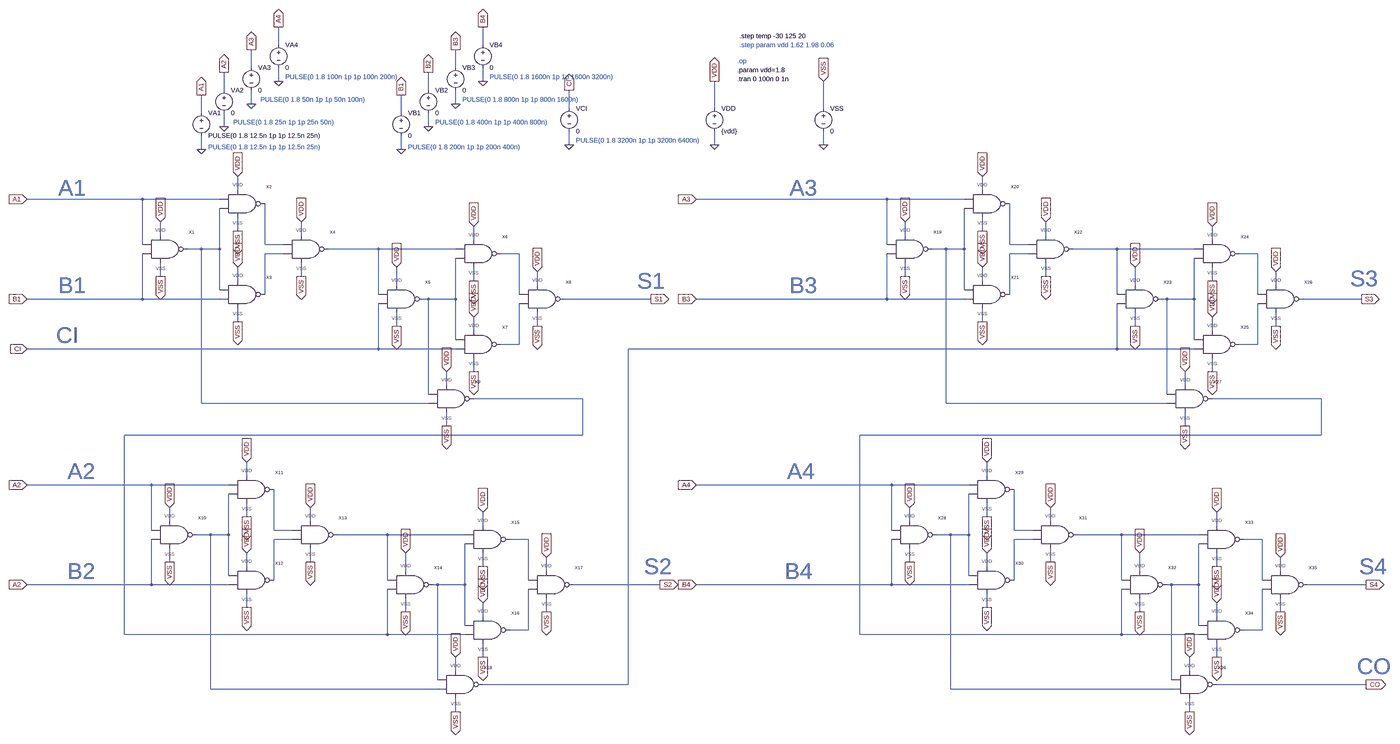
[diagram p0: schematic sumator4bit.asc, whole sheet]
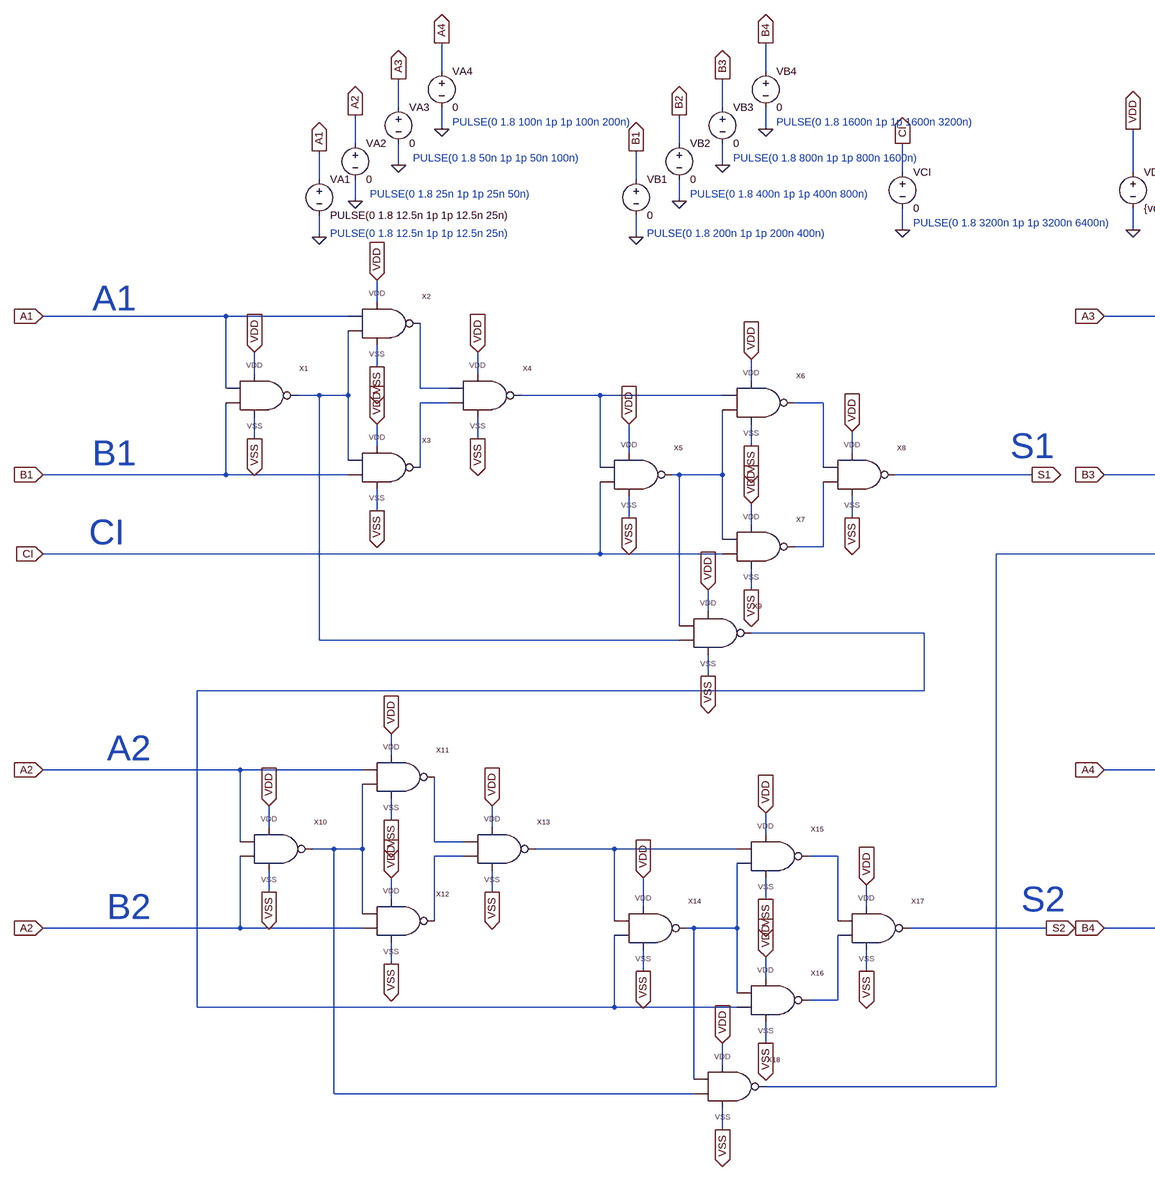
[diagram p1: schematic sumator4bit.asc, part, row 1 of 1, column 1 of 2]
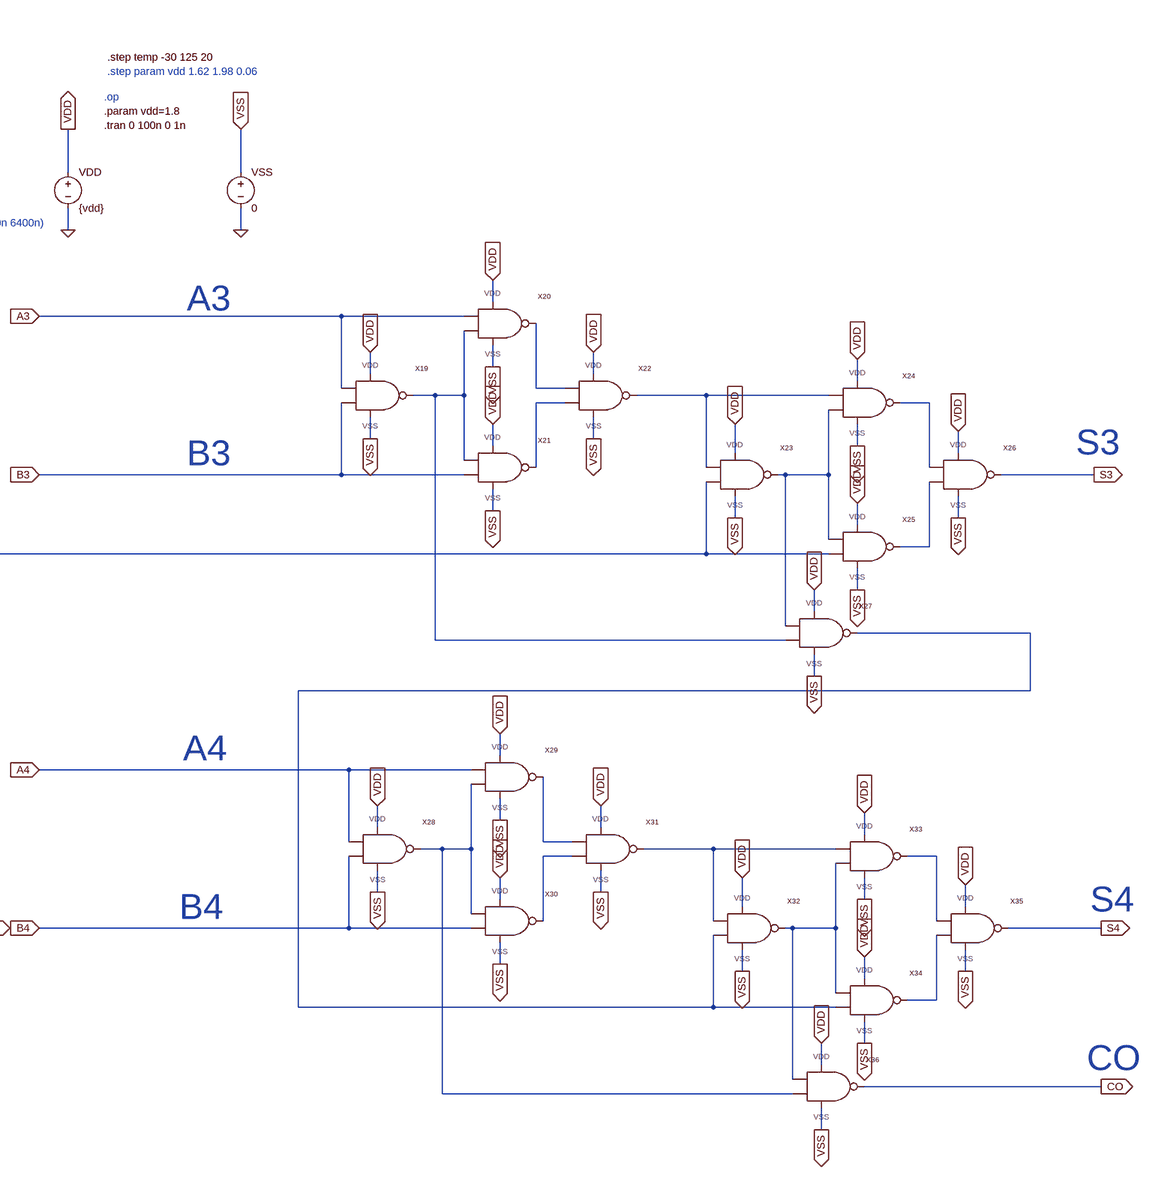
[diagram p2: schematic sumator4bit.asc, part, row 1 of 1, column 2 of 2]
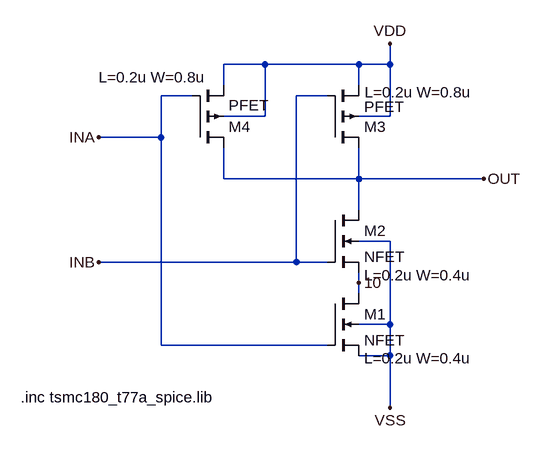
[diagram p3: sub-circuit nand.asc]
sumator4bit.asc, the LTspice schematic file:
Version 4
SHEET 1 4428 3956
WIRE 176 -640 176 -704
WIRE 896 -640 896 -704
WIRE 80 -560 80 -624
WIRE 800 -560 800 -624
WIRE 176 -512 176 -560
WIRE 896 -512 896 -560
WIRE -16 -480 -16 -544
WIRE 704 -480 704 -544
WIRE 80 -432 80 -480
WIRE 800 -432 800 -480
WIRE 1200 -416 1200 -480
WIRE 1712 -416 1712 -512
WIRE 2096 -416 2096 -512
WIRE -96 -400 -96 -464
WIRE 608 -400 608 -464
WIRE -16 -352 -16 -400
WIRE 704 -352 704 -400
WIRE 1200 -288 1200 -336
WIRE 1712 -288 1712 -336
WIRE 2096 -288 2096 -336
WIRE -96 -272 -96 -320
WIRE 608 -272 608 -320
WIRE 32 -128 32 -176
WIRE 2656 -128 2656 -176
WIRE -304 -96 -944 -96
WIRE -32 -96 -304 -96
WIRE 2320 -96 1648 -96
WIRE 2592 -96 2320 -96
WIRE 32 16 32 -32
WIRE 2656 16 2656 -32
WIRE -240 32 -240 -16
WIRE 256 32 256 -16
WIRE 2384 32 2384 -16
WIRE 2880 32 2880 -16
WIRE 864 48 864 0
WIRE 3488 48 3488 0
WIRE -304 64 -304 -96
WIRE 128 64 128 -80
WIRE 192 64 128 64
WIRE 2320 64 2320 -96
WIRE 2752 64 2752 -80
WIRE 2816 64 2752 64
WIRE -96 80 -144 80
WIRE -32 80 -32 -64
WIRE -32 80 -96 80
WIRE 528 80 352 80
WIRE 800 80 528 80
WIRE 2528 80 2480 80
WIRE 2592 80 2592 -64
WIRE 2592 80 2528 80
WIRE 3152 80 2976 80
WIRE 3424 80 3152 80
WIRE 192 96 128 96
WIRE 1024 96 960 96
WIRE 2816 96 2752 96
WIRE 3648 96 3584 96
WIRE -240 176 -240 128
WIRE 256 176 256 128
WIRE 2384 176 2384 128
WIRE 2880 176 2880 128
WIRE 32 192 32 144
WIRE 864 192 864 144
WIRE 2656 192 2656 144
WIRE 3488 192 3488 144
WIRE 592 208 592 144
WIRE 1088 208 1088 160
WIRE 3216 208 3216 144
WIRE 3712 208 3712 160
WIRE -32 224 -32 80
WIRE 2592 224 2592 80
WIRE 128 240 128 96
WIRE 528 240 528 80
WIRE 1024 240 1024 96
WIRE 2752 240 2752 96
WIRE 3152 240 3152 80
WIRE 3648 240 3648 96
WIRE -304 256 -304 96
WIRE -304 256 -944 256
WIRE -32 256 -304 256
WIRE 704 256 688 256
WIRE 800 256 800 112
WIRE 800 256 704 256
WIRE 1488 256 1184 256
WIRE 2320 256 2320 96
WIRE 2320 256 1648 256
WIRE 2592 256 2320 256
WIRE 3328 256 3312 256
WIRE 3424 256 3424 112
WIRE 3424 256 3328 256
WIRE 4112 256 3808 256
WIRE 32 336 32 288
WIRE 2656 336 2656 288
WIRE 592 352 592 304
WIRE 1088 352 1088 304
WIRE 3216 352 3216 304
WIRE 3712 352 3712 304
WIRE 864 368 864 320
WIRE 3488 368 3488 320
WIRE 800 400 800 256
WIRE 3424 400 3424 256
WIRE 1024 416 1024 272
WIRE 1024 416 960 416
WIRE 3648 416 3648 272
WIRE 3648 416 3584 416
WIRE 528 432 528 272
WIRE 528 432 -944 432
WIRE 800 432 528 432
WIRE 3152 432 3152 272
WIRE 3152 432 1408 432
WIRE 3424 432 3152 432
WIRE 864 512 864 464
WIRE 3488 512 3488 464
WIRE 768 560 768 512
WIRE 3392 560 3392 512
WIRE 704 592 704 256
WIRE 3328 592 3328 256
WIRE 1248 608 864 608
WIRE 3872 608 3488 608
WIRE -96 624 -96 80
WIRE 704 624 -96 624
WIRE 2528 624 2528 80
WIRE 3328 624 2528 624
WIRE 768 704 768 656
WIRE 3392 704 3392 656
WIRE 1248 736 1248 608
WIRE 1248 736 -368 736
WIRE 3872 736 3872 608
WIRE 3872 736 2224 736
WIRE 64 880 64 832
WIRE 2672 880 2672 832
WIRE -272 912 -944 912
WIRE 0 912 -272 912
WIRE 2336 912 1648 912
WIRE 2608 912 2336 912
WIRE 64 1024 64 976
WIRE 2672 1024 2672 976
WIRE -208 1040 -208 992
WIRE 288 1040 288 992
WIRE 2400 1040 2400 992
WIRE 2896 1040 2896 992
WIRE 896 1056 896 1008
WIRE 3504 1056 3504 1008
WIRE -272 1072 -272 912
WIRE 160 1072 160 928
WIRE 224 1072 160 1072
WIRE 2336 1072 2336 912
WIRE 2768 1072 2768 928
WIRE 2832 1072 2768 1072
WIRE -64 1088 -112 1088
WIRE 0 1088 0 944
WIRE 0 1088 -64 1088
WIRE 560 1088 384 1088
WIRE 832 1088 560 1088
WIRE 2544 1088 2496 1088
WIRE 2608 1088 2608 944
WIRE 2608 1088 2544 1088
WIRE 3168 1088 2992 1088
WIRE 3440 1088 3168 1088
WIRE 224 1104 160 1104
WIRE 1056 1104 992 1104
WIRE 2832 1104 2768 1104
WIRE 3664 1104 3600 1104
WIRE -208 1184 -208 1136
WIRE 288 1184 288 1136
WIRE 2400 1184 2400 1136
WIRE 2896 1184 2896 1136
WIRE 64 1200 64 1152
WIRE 896 1200 896 1152
WIRE 2672 1200 2672 1152
WIRE 3504 1200 3504 1152
WIRE 624 1216 624 1152
WIRE 1120 1216 1120 1168
WIRE 3232 1216 3232 1152
WIRE 3728 1216 3728 1168
WIRE 0 1232 0 1088
WIRE 2608 1232 2608 1088
WIRE 160 1248 160 1104
WIRE 560 1248 560 1088
WIRE 1056 1248 1056 1104
WIRE 2768 1248 2768 1104
WIRE 3168 1248 3168 1088
WIRE 3664 1248 3664 1104
WIRE -272 1264 -272 1104
WIRE -272 1264 -944 1264
WIRE 0 1264 -272 1264
WIRE 736 1264 720 1264
WIRE 832 1264 832 1120
WIRE 832 1264 736 1264
WIRE 1520 1264 1216 1264
WIRE 2336 1264 2336 1104
WIRE 2336 1264 1648 1264
WIRE 2608 1264 2336 1264
WIRE 3344 1264 3328 1264
WIRE 3440 1264 3440 1120
WIRE 3440 1264 3344 1264
WIRE 4128 1264 3824 1264
WIRE 64 1344 64 1296
WIRE 2672 1344 2672 1296
WIRE 624 1360 624 1312
WIRE 1120 1360 1120 1312
WIRE 3232 1360 3232 1312
WIRE 3728 1360 3728 1312
WIRE 896 1376 896 1328
WIRE 3504 1376 3504 1328
WIRE 832 1408 832 1264
WIRE 3440 1408 3440 1264
WIRE 1056 1424 1056 1280
WIRE 1056 1424 992 1424
WIRE 3664 1424 3664 1280
WIRE 3664 1424 3600 1424
WIRE -368 1440 -368 736
WIRE 560 1440 560 1280
WIRE 560 1440 -368 1440
WIRE 832 1440 560 1440
WIRE 2224 1440 2224 736
WIRE 3168 1440 3168 1280
WIRE 3168 1440 2224 1440
WIRE 3440 1440 3168 1440
WIRE 896 1520 896 1472
WIRE 3504 1520 3504 1472
WIRE 800 1568 800 1520
WIRE 3408 1568 3408 1520
WIRE 736 1600 736 1264
WIRE 3344 1600 3344 1264
WIRE 1408 1616 1408 432
WIRE 1408 1616 896 1616
WIRE 4128 1616 3504 1616
WIRE -64 1632 -64 1088
WIRE 736 1632 -64 1632
WIRE 2544 1632 2544 1088
WIRE 3344 1632 2544 1632
WIRE 800 1712 800 1664
WIRE 3408 1712 3408 1664
FLAG 1488 256 S1
IOPIN 1488 256 Out
FLAG 608 -272 0
FLAG -96 -272 0
FLAG 1712 -512 VDD
IOPIN 1712 -512 Out
FLAG 32 -176 VDD
IOPIN 32 -176 In
FLAG 32 144 VDD
IOPIN 32 144 In
FLAG -240 -16 VDD
IOPIN -240 -16 In
FLAG 256 -16 VDD
IOPIN 256 -16 In
FLAG 592 144 VDD
IOPIN 592 144 In
FLAG 864 320 VDD
IOPIN 864 320 In
FLAG 1088 160 VDD
IOPIN 1088 160 In
FLAG 864 0 VDD
IOPIN 864 0 In
FLAG 768 512 VDD
IOPIN 768 512 In
FLAG 1712 -288 0
FLAG 1200 -288 0
FLAG 1520 1264 S2
IOPIN 1520 1264 Out
FLAG 64 832 VDD
IOPIN 64 832 In
FLAG 64 1152 VDD
IOPIN 64 1152 In
FLAG -208 992 VDD
IOPIN -208 992 In
FLAG 288 992 VDD
IOPIN 288 992 In
FLAG 624 1152 VDD
IOPIN 624 1152 In
FLAG 896 1328 VDD
IOPIN 896 1328 In
FLAG 1120 1168 VDD
IOPIN 1120 1168 In
FLAG 896 1008 VDD
IOPIN 896 1008 In
FLAG 800 1520 VDD
IOPIN 800 1520 In
FLAG 4112 256 S3
IOPIN 4112 256 Out
FLAG 2656 -176 VDD
IOPIN 2656 -176 In
FLAG 2656 144 VDD
IOPIN 2656 144 In
FLAG 2384 -16 VDD
IOPIN 2384 -16 In
FLAG 2880 -16 VDD
IOPIN 2880 -16 In
FLAG 3216 144 VDD
IOPIN 3216 144 In
FLAG 3488 320 VDD
IOPIN 3488 320 In
FLAG 3712 160 VDD
IOPIN 3712 160 In
FLAG 3488 0 VDD
IOPIN 3488 0 In
FLAG 3392 512 VDD
IOPIN 3392 512 In
FLAG 4128 1264 S4
IOPIN 4128 1264 Out
FLAG 2672 832 VDD
IOPIN 2672 832 In
FLAG 2672 1152 VDD
IOPIN 2672 1152 In
FLAG 2400 992 VDD
IOPIN 2400 992 In
FLAG 2896 992 VDD
IOPIN 2896 992 In
FLAG 3232 1152 VDD
IOPIN 3232 1152 In
FLAG 3504 1328 VDD
IOPIN 3504 1328 In
FLAG 3728 1168 VDD
IOPIN 3728 1168 In
FLAG 3504 1008 VDD
IOPIN 3504 1008 In
FLAG 3408 1520 VDD
IOPIN 3408 1520 In
FLAG 4128 1616 CO
IOPIN 4128 1616 Out
FLAG -16 -352 0
FLAG 704 -352 0
FLAG 80 -432 0
FLAG 800 -432 0
FLAG 176 -512 0
FLAG 896 -512 0
FLAG -96 -464 A1
IOPIN -96 -464 Out
FLAG -16 -544 A2
IOPIN -16 -544 Out
FLAG 80 -624 A3
IOPIN 80 -624 Out
FLAG 176 -704 A4
IOPIN 176 -704 Out
FLAG 608 -464 B1
IOPIN 608 -464 Out
FLAG 704 -544 B2
IOPIN 704 -544 Out
FLAG 800 -624 B3
IOPIN 800 -624 Out
FLAG 896 -704 B4
IOPIN 896 -704 Out
FLAG 1200 -480 CI
IOPIN 1200 -480 Out
FLAG -944 -96 A1
IOPIN -944 -96 In
FLAG -944 256 B1
IOPIN -944 256 In
FLAG -944 432 CI
IOPIN -944 432 In
FLAG -944 912 A2
IOPIN -944 912 In
FLAG -944 1264 A2
IOPIN -944 1264 In
FLAG 1648 -96 A3
IOPIN 1648 -96 In
FLAG 1648 256 B3
IOPIN 1648 256 In
FLAG 1648 912 A4
IOPIN 1648 912 In
FLAG 1648 1264 B4
IOPIN 1648 1264 In
FLAG 2096 -288 0
FLAG 2096 -512 VSS
IOPIN 2096 -512 In
FLAG -240 176 VSS
IOPIN -240 176 Out
FLAG 32 16 VSS
IOPIN 32 16 Out
FLAG 32 336 VSS
IOPIN 32 336 Out
FLAG 256 176 VSS
IOPIN 256 176 Out
FLAG 592 352 VSS
IOPIN 592 352 Out
FLAG 864 192 VSS
IOPIN 864 192 Out
FLAG 1088 352 VSS
IOPIN 1088 352 Out
FLAG 864 512 VSS
IOPIN 864 512 Out
FLAG 768 704 VSS
IOPIN 768 704 Out
FLAG -208 1184 VSS
IOPIN -208 1184 Out
FLAG 64 1024 VSS
IOPIN 64 1024 Out
FLAG 288 1184 VSS
IOPIN 288 1184 Out
FLAG 64 1344 VSS
IOPIN 64 1344 Out
FLAG 624 1360 VSS
IOPIN 624 1360 Out
FLAG 896 1200 VSS
IOPIN 896 1200 Out
FLAG 1120 1360 VSS
IOPIN 1120 1360 Out
FLAG 896 1520 VSS
IOPIN 896 1520 Out
FLAG 800 1712 VSS
IOPIN 800 1712 Out
FLAG 2400 1184 VSS
IOPIN 2400 1184 Out
FLAG 2672 1344 VSS
IOPIN 2672 1344 Out
FLAG 2896 1184 VSS
IOPIN 2896 1184 Out
FLAG 2672 1024 VSS
IOPIN 2672 1024 Out
FLAG 2384 176 VSS
IOPIN 2384 176 Out
FLAG 2656 16 VSS
IOPIN 2656 16 Out
FLAG 2656 336 VSS
IOPIN 2656 336 Out
FLAG 2880 176 VSS
IOPIN 2880 176 Out
FLAG 3216 352 VSS
IOPIN 3216 352 Out
FLAG 3488 512 VSS
IOPIN 3488 512 Out
FLAG 3712 352 VSS
IOPIN 3712 352 Out
FLAG 3488 192 VSS
IOPIN 3488 192 Out
FLAG 3392 704 VSS
IOPIN 3392 704 Out
FLAG 3504 1200 VSS
IOPIN 3504 1200 Out
FLAG 3232 1360 VSS
IOPIN 3232 1360 Out
FLAG 3728 1360 VSS
IOPIN 3728 1360 Out
FLAG 3504 1520 VSS
IOPIN 3504 1520 Out
FLAG 3408 1712 VSS
IOPIN 3408 1712 Out
SYMBOL NAND -240 80 R0
SYMATTR InstName X1
SYMBOL voltage 1712 -432 R0
WINDOW 123 0 0 Left 0
WINDOW 39 0 0 Left 0
SYMATTR InstName VDD
SYMATTR Value {vdd}
SYMBOL voltage 608 -416 R0
WINDOW 123 0 0 Left 0
WINDOW 39 0 0 Left 0
SYMATTR InstName VB1
SYMATTR Value 0
SYMBOL voltage -96 -416 R0
WINDOW 123 0 0 Left 0
WINDOW 39 0 0 Left 0
SYMATTR InstName VA1
SYMATTR Value PULSE(0 1.8 12.5n 1p 1p 12.5n 25n)
SYMBOL NAND 32 -80 R0
SYMATTR InstName X2
SYMBOL NAND 32 240 R0
SYMATTR InstName X3
SYMBOL NAND 256 80 R0
SYMATTR InstName X4
SYMBOL NAND 592 256 R0
SYMATTR InstName X5
SYMBOL NAND 864 96 R0
SYMATTR InstName X6
SYMBOL NAND 864 416 R0
SYMATTR InstName X7
SYMBOL NAND 1088 256 R0
SYMATTR InstName X8
SYMBOL NAND 768 608 R0
SYMATTR InstName X9
SYMBOL voltage 1200 -432 R0
WINDOW 123 0 0 Left 0
WINDOW 39 0 0 Left 0
SYMATTR InstName VCI
SYMATTR Value 0
SYMBOL NAND -208 1088 R0
SYMATTR InstName X10
SYMBOL NAND 64 928 R0
SYMATTR InstName X11
SYMBOL NAND 64 1248 R0
SYMATTR InstName X12
SYMBOL NAND 288 1088 R0
SYMATTR InstName X13
SYMBOL NAND 624 1264 R0
SYMATTR InstName X14
SYMBOL NAND 896 1104 R0
SYMATTR InstName X15
SYMBOL NAND 896 1424 R0
SYMATTR InstName X16
SYMBOL NAND 1120 1264 R0
SYMATTR InstName X17
SYMBOL NAND 800 1616 R0
SYMATTR InstName X18
SYMBOL NAND 2384 80 R0
SYMATTR InstName X19
SYMBOL NAND 2656 -80 R0
SYMATTR InstName X20
SYMBOL NAND 2656 240 R0
SYMATTR InstName X21
SYMBOL NAND 2880 80 R0
SYMATTR InstName X22
SYMBOL NAND 3216 256 R0
SYMATTR InstName X23
SYMBOL NAND 3488 96 R0
SYMATTR InstName X24
SYMBOL NAND 3488 416 R0
SYMATTR InstName X25
SYMBOL NAND 3712 256 R0
SYMATTR InstName X26
SYMBOL NAND 3392 608 R0
SYMATTR InstName X27
SYMBOL NAND 2400 1088 R0
SYMATTR InstName X28
SYMBOL NAND 2672 928 R0
SYMATTR InstName X29
SYMBOL NAND 2672 1248 R0
SYMATTR InstName X30
SYMBOL NAND 2896 1088 R0
SYMATTR InstName X31
SYMBOL NAND 3232 1264 R0
SYMATTR InstName X32
SYMBOL NAND 3504 1104 R0
SYMATTR InstName X33
SYMBOL NAND 3504 1424 R0
SYMATTR InstName X34
SYMBOL NAND 3728 1264 R0
SYMATTR InstName X35
SYMBOL NAND 3408 1616 R0
SYMATTR InstName X36
SYMBOL voltage -16 -496 R0
WINDOW 123 0 0 Left 0
WINDOW 39 0 0 Left 0
SYMATTR InstName VA2
SYMATTR Value 0
SYMBOL voltage 704 -496 R0
WINDOW 123 0 0 Left 0
WINDOW 39 0 0 Left 0
SYMATTR InstName VB2
SYMATTR Value 0
SYMBOL voltage 80 -576 R0
WINDOW 123 0 0 Left 0
WINDOW 39 0 0 Left 0
SYMATTR InstName VA3
SYMATTR Value 0
SYMBOL voltage 800 -576 R0
WINDOW 123 0 0 Left 0
WINDOW 39 0 0 Left 0
SYMATTR InstName VB3
SYMATTR Value 0
SYMBOL voltage 176 -656 R0
WINDOW 123 0 0 Left 0
WINDOW 39 0 0 Left 0
SYMATTR InstName VA4
SYMATTR Value 0
SYMBOL voltage 896 -656 R0
WINDOW 123 0 0 Left 0
WINDOW 39 0 0 Left 0
SYMATTR InstName VB4
SYMATTR Value 0
SYMBOL voltage 2096 -432 R0
WINDOW 123 0 0 Left 0
WINDOW 39 0 0 Left 0
SYMATTR InstName VSS
SYMATTR Value 0
TEXT 1792 -584 Left 2 ;.op
TEXT 1792 -520 Left 2 !.tran 0 100n 0 1n
TEXT 1440 192 Left 6 ;S1
TEXT 1464 1200 Left 6 ;S2
TEXT 4072 184 Left 6 ;S3
TEXT 4104 1200 Left 6 ;S4
TEXT 4096 1552 Left 6 ;CO
TEXT -728 384 Left 6 ;CI
TEXT -720 -136 Left 6 ;A1
TEXT -720 208 Left 6 ;B1
TEXT -688 864 Left 6 ;A2
TEXT 1976 -136 Left 6 ;A3
TEXT 1968 864 Left 6 ;A4
TEXT -688 1216 Left 6 ;B2
TEXT 1976 208 Left 6 ;B3
TEXT 1960 1216 Left 6 ;B4
TEXT -72 -280 Left 2 ;PULSE(0 1.8 12.5n 1p 1p 12.5n 25n)
TEXT 16 -368 Left 2 ;PULSE(0 1.8 25n 1p 1p 25n 50n)
TEXT 112 -448 Left 2 ;PULSE(0 1.8 50n 1p 1p 50n 100n)
TEXT 200 -528 Left 2 ;PULSE(0 1.8 100n 1p 1p 100n 200n)
TEXT 632 -280 Left 2 ;PULSE(0 1.8 200n 1p 1p 200n 400n)
TEXT 728 -368 Left 2 ;PULSE(0 1.8 400n 1p 1p 400n 800n)
TEXT 824 -448 Left 2 ;PULSE(0 1.8 800n 1p 1p 800n 1600n)
TEXT 920 -528 Left 2 ;PULSE(0 1.8 1600n 1p 1p 1600n 3200n)
TEXT 1224 -304 Left 2 ;PULSE(0 1.8 3200n 1p 1p 3200n 6400n)
TEXT 1792 -552 Left 2 !.param vdd=1.8
TEXT 1800 -640 Left 2 ;.step param vdd 1.62 1.98 0.06
TEXT 1800 -672 Left 2 !.step temp -30 125 20

nand.asc, the sub-circuit schematic file:
Version 4
SHEET 1 880 680
WIRE 144 -208 80 -208
WIRE 288 -208 144 -208
WIRE 336 -208 336 -240
WIRE 336 -208 288 -208
WIRE 80 -176 80 -208
WIRE 288 -176 288 -208
WIRE 32 -160 -16 -160
WIRE 240 -160 192 -160
WIRE 144 -128 144 -208
WIRE 144 -128 80 -128
WIRE 336 -128 336 -208
WIRE 336 -128 288 -128
WIRE -16 -96 -16 -160
WIRE -16 -96 -112 -96
WIRE 80 -32 80 -80
WIRE 288 -32 288 -80
WIRE 288 -32 80 -32
WIRE 480 -32 288 -32
WIRE 288 16 288 -32
WIRE 336 64 288 64
WIRE 192 96 192 -160
WIRE 192 96 -112 96
WIRE 240 96 192 96
WIRE 288 128 288 112
WIRE 288 144 288 128
WIRE 336 192 336 64
WIRE 336 192 288 192
WIRE -16 224 -16 -96
WIRE 240 224 -16 224
WIRE 336 240 336 192
WIRE 336 240 288 240
WIRE 336 320 336 240
FLAG 336 -240 VDD
FLAG 480 -32 OUT
FLAG -112 -96 INA
FLAG -112 96 INB
FLAG 336 320 VSS
FLAG 288 128 10
SYMBOL nmos4 240 144 R0
WINDOW 123 56 100 Left 2
SYMATTR Value2 L=0.2u W=0.4u
SYMATTR InstName M1
SYMATTR Value NFET
SYMBOL nmos4 240 16 R0
WINDOW 123 56 100 Left 2
SYMATTR Value2 L=0.2u W=0.4u
SYMATTR InstName M2
SYMATTR Value NFET
SYMBOL pmos4 240 -80 M180
WINDOW 3 56 63 Left 2
WINDOW 123 57 85 Left 2
SYMATTR Value PFET
SYMATTR Value2 L=0.2u W=0.8u
SYMATTR InstName M3
SYMBOL pmos4 32 -80 M180
WINDOW 3 56 65 Left 2
WINDOW 123 -144 108 Left 2
SYMATTR Value PFET
SYMATTR Value2 L=0.2u W=0.8u
SYMATTR InstName M4
TEXT -232 304 Left 2 !.inc tsmc180_t77a_spice.lib

The netlist it stands for:
* sumator4bit.asc
XX1 A1 B1 N003 VDD VSS nand
VDD VDD 0 {vdd}
VB1 B1 0 0
VA1 A1 0 PULSE(0 1.8 12.5n 1p 1p 12.5n 25n)
XX2 A1 N003 N001 VDD VSS nand
XX3 N003 B1 N007 VDD VSS nand
XX4 N001 N007 N004 VDD VSS nand
XX5 N004 CI N011 VDD VSS nand
XX6 N004 N011 N008 VDD VSS nand
XX7 N011 CI N013 VDD VSS nand
XX8 N008 N013 S1 VDD VSS nand
XX9 N011 N003 N016 VDD VSS nand
VCI CI 0 0
XX10 A2 A2 N020 VDD VSS nand
XX11 A2 N020 N018 VDD VSS nand
XX12 N020 A2 N024 VDD VSS nand
XX13 N018 N024 N021 VDD VSS nand
XX14 N021 N016 N028 VDD VSS nand
XX15 N021 N028 N025 VDD VSS nand
XX16 N028 N016 N030 VDD VSS nand
XX17 N025 N030 S2 VDD VSS nand
XX18 N028 N020 N015 VDD VSS nand
XX19 A3 B3 N005 VDD VSS nand
XX20 A3 N005 N002 VDD VSS nand
XX21 N005 B3 N009 VDD VSS nand
XX22 N002 N009 N006 VDD VSS nand
XX23 N006 N015 N012 VDD VSS nand
XX24 N006 N012 N010 VDD VSS nand
XX25 N012 N015 N014 VDD VSS nand
XX26 N010 N014 S3 VDD VSS nand
XX27 N012 N005 N017 VDD VSS nand
XX28 A4 B4 N022 VDD VSS nand
XX29 A4 N022 N019 VDD VSS nand
XX30 N022 B4 N026 VDD VSS nand
XX31 N019 N026 N023 VDD VSS nand
XX32 N023 N017 N029 VDD VSS nand
XX33 N023 N029 N027 VDD VSS nand
XX34 N029 N017 N031 VDD VSS nand
XX35 N027 N031 S4 VDD VSS nand
XX36 N029 N022 CO VDD VSS nand
VA2 A2 0 0
VB2 B2 0 0
VA3 A3 0 0
VB3 B3 0 0
VA4 A4 0 0
VB4 B4 0 0
VSS VSS 0 0

* block symbol definitions
.subckt nand INA INB OUT VDD VSS
M1 10 INA VSS VSS NFET L=0.2u W=0.4u
M2 OUT INB 10 VSS NFET L=0.2u W=0.4u
M3 OUT INB VDD VDD PFET L=0.2u W=0.8u
M4 OUT INA VDD VDD PFET L=0.2u W=0.8u
.inc tsmc180_t77a_spice.lib
.ends nand

.model NMOS NMOS
.model PMOS PMOS
.lib standard.mos
* .op
.tran 0 100n 0 1n
* S1
* S2
* S3
* S4
* CO
* CI
* A1
* B1
* A2
* A3
* A4
* B2
* B3
* B4
* PULSE(0 1.8 12.5n 1p 1p 12.5n 25n)
* PULSE(0 1.8 25n 1p 1p 25n 50n)
* PULSE(0 1.8 50n 1p 1p 50n 100n)
* PULSE(0 1.8 100n 1p 1p 100n 200n)
* PULSE(0 1.8 200n 1p 1p 200n 400n)
* PULSE(0 1.8 400n 1p 1p 400n 800n)
* PULSE(0 1.8 800n 1p 1p 800n 1600n)
* PULSE(0 1.8 1600n 1p 1p 1600n 3200n)
* PULSE(0 1.8 3200n 1p 1p 3200n 6400n)
.param vdd=1.8
* .step param vdd 1.62 1.98 0.06
.step temp -30 125 20
.backanno
.end